# EAGLE schematic clock_PC_and_instruction_reg (EAGLE 9.6.1)
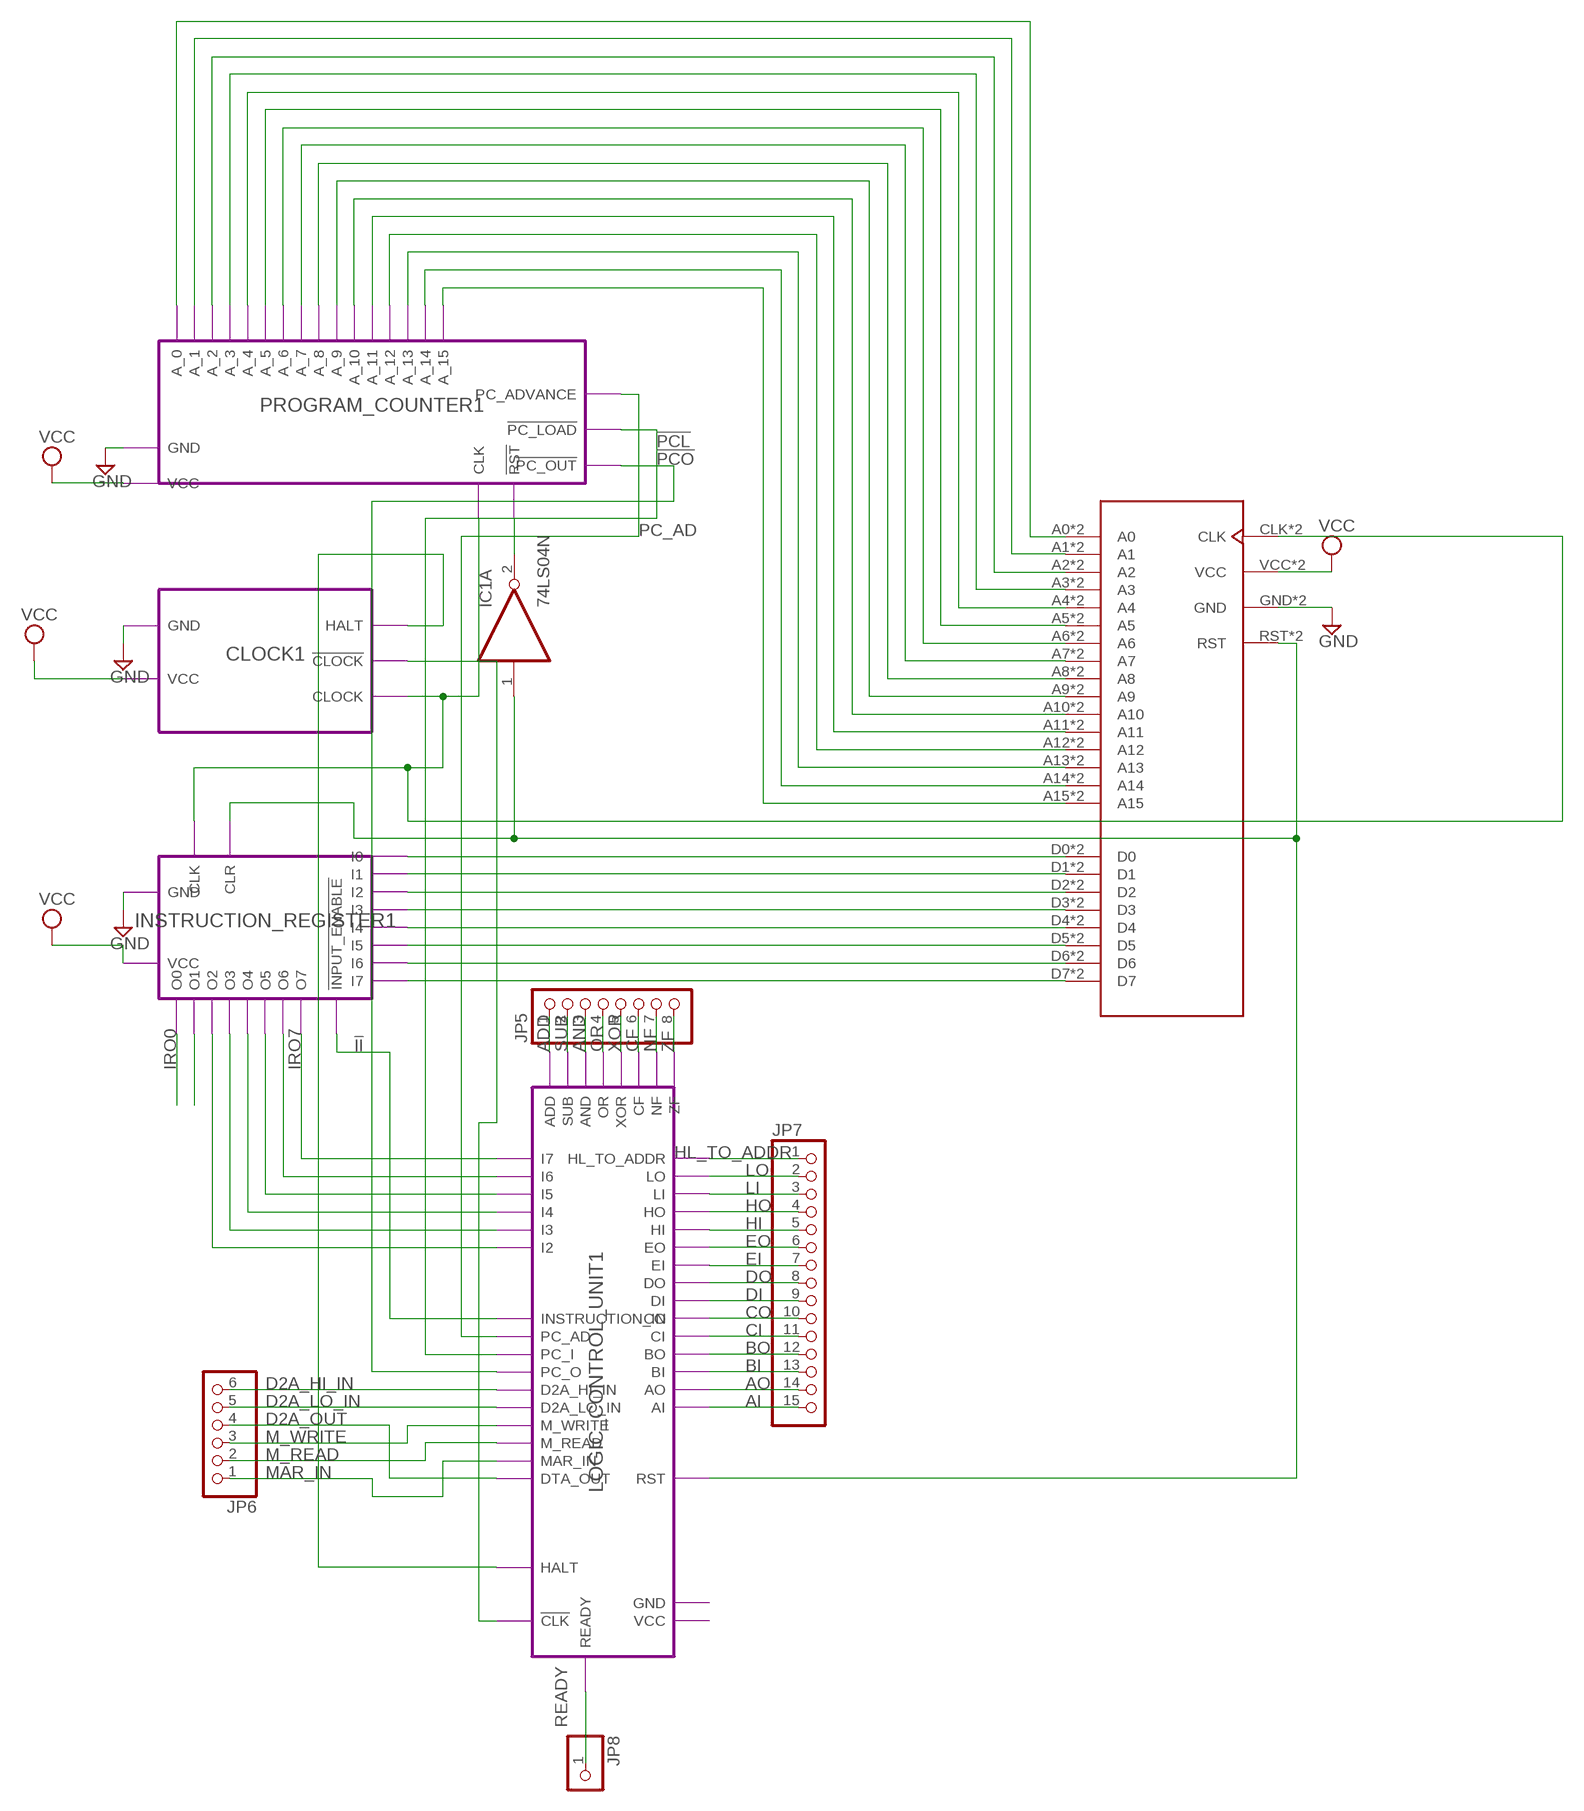
[diagram p0: schematic, sheet 1]

## Parts
IC1  74LS04N  [DIL14]
JP5  PINHD-1X8/90  [1X08/90]
JP6  PINHD-1X6/90  [1X06/90]
JP7  PINHD-1X15/90  [1X15/90]
JP8  PINHD-1X1  [1X01]
U$1  PORT_BOARD  [PORT_FOOTPT]

## Module instances
CLOCK1 = CLOCK
PROGRAM_COUNTER1 = PROGRAM_COUNTER
INSTRUCTION_REGISTER1 = INSTRUCTION_REGISTER
LOGIC_CONTROL_UNIT1 = LOGIC_CONTROL_UNIT

## Nets
!II: port INSTRUCTION_REGISTER1.!INPUT_ENABLE LOGIC_CONTROL_UNIT1.INSTRUCTION_IN
!PCL: port PROGRAM_COUNTER1.!PC_LOAD LOGIC_CONTROL_UNIT1.PC_I
!PCO: port PROGRAM_COUNTER1.!PC_OUT LOGIC_CONTROL_UNIT1.PC_O
ADD: JP5.1 ; port LOGIC_CONTROL_UNIT1.ADD
AI: JP7.15 ; port LOGIC_CONTROL_UNIT1.AI
AND: JP5.3 ; port LOGIC_CONTROL_UNIT1.AND
AO: JP7.14 ; port LOGIC_CONTROL_UNIT1.AO
BI: JP7.13 ; port LOGIC_CONTROL_UNIT1.BI
BO: JP7.12 ; port LOGIC_CONTROL_UNIT1.BO
CF: JP5.6 ; port LOGIC_CONTROL_UNIT1.CF
CI: JP7.11 ; port LOGIC_CONTROL_UNIT1.CI
CO: JP7.10 ; port LOGIC_CONTROL_UNIT1.CO
D2A_HI_IN: JP6.6 ; port LOGIC_CONTROL_UNIT1.D2A_HI_IN
D2A_LO_IN: JP6.5 ; port LOGIC_CONTROL_UNIT1.D2A_LO_IN
D2A_OUT: JP6.4 ; port LOGIC_CONTROL_UNIT1.DTA_OUT
DI: JP7.9 ; port LOGIC_CONTROL_UNIT1.DI
DO: JP7.8 ; port LOGIC_CONTROL_UNIT1.DO
EI: JP7.7 ; port LOGIC_CONTROL_UNIT1.EI
EO: JP7.6 ; port LOGIC_CONTROL_UNIT1.EO
GND: U$1.GND U$1.GND1(GND) ; port PROGRAM_COUNTER1.GND CLOCK1.GND INSTRUCTION_REGISTER1.GND
HALT: port CLOCK1.HALT LOGIC_CONTROL_UNIT1.HALT
HI: JP7.5 ; port LOGIC_CONTROL_UNIT1.HI
HL_TO_ADDR: JP7.1 ; port LOGIC_CONTROL_UNIT1.HL_TO_ADDR
HO: JP7.4 ; port LOGIC_CONTROL_UNIT1.HO
IRO0: port INSTRUCTION_REGISTER1.O0
IRO7: port INSTRUCTION_REGISTER1.O7 LOGIC_CONTROL_UNIT1.I7
LI: JP7.3 ; port LOGIC_CONTROL_UNIT1.LI
LO: JP7.2 ; port LOGIC_CONTROL_UNIT1.LO
M_READ: JP6.2 ; port LOGIC_CONTROL_UNIT1.M_READ
M_WRITE: JP6.3 ; port LOGIC_CONTROL_UNIT1.M_WRITE
MAR_IN: JP6.1 ; port LOGIC_CONTROL_UNIT1.MAR_IN
N$1: U$1.A15 U$1.A31(A15) ; port PROGRAM_COUNTER1.A_15
N$2: U$1.A14 U$1.A30(A14) ; port PROGRAM_COUNTER1.A_14
N$3: U$1.A13 U$1.A29(A13) ; port PROGRAM_COUNTER1.A_13
N$4: U$1.A12 U$1.A28(A12) ; port PROGRAM_COUNTER1.A_12
N$5: U$1.A11 U$1.A27(A11) ; port PROGRAM_COUNTER1.A_11
N$6: U$1.A10 U$1.A26(A10) ; port PROGRAM_COUNTER1.A_10
N$7: U$1.A9 U$1.A25(A9) ; port PROGRAM_COUNTER1.A_9
N$8: U$1.A8 U$1.A24(A8) ; port PROGRAM_COUNTER1.A_8
N$9: U$1.A7 U$1.A23(A7) ; port PROGRAM_COUNTER1.A_7
N$10: U$1.A6 U$1.A22(A6) ; port PROGRAM_COUNTER1.A_6
N$11: U$1.A5 U$1.A21(A5) ; port PROGRAM_COUNTER1.A_5
N$12: U$1.A4 U$1.A20(A4) ; port PROGRAM_COUNTER1.A_4
N$13: U$1.A3 U$1.A19(A3) ; port PROGRAM_COUNTER1.A_3
N$14: U$1.A2 U$1.A18(A2) ; port PROGRAM_COUNTER1.A_2
N$15: U$1.A1 U$1.A17(A1) ; port PROGRAM_COUNTER1.A_1
N$16: U$1.A0 U$1.A16(A0) ; port PROGRAM_COUNTER1.A_0
N$17: U$1.D0 U$1.D8(D0) ; port INSTRUCTION_REGISTER1.I0
N$18: U$1.D1 U$1.D9(D1) ; port INSTRUCTION_REGISTER1.I1
N$19: U$1.D2 U$1.D10(D2) ; port INSTRUCTION_REGISTER1.I2
N$20: U$1.D3 U$1.D11(D3) ; port INSTRUCTION_REGISTER1.I3
N$21: U$1.D4 U$1.D12(D4) ; port INSTRUCTION_REGISTER1.I4
N$22: U$1.D5 U$1.D13(D5) ; port INSTRUCTION_REGISTER1.I5
N$23: U$1.D6 U$1.D14(D6) ; port INSTRUCTION_REGISTER1.I6
N$24: U$1.D7 U$1.D15(D7) ; port INSTRUCTION_REGISTER1.I7
N$25: U$1.CLK U$1.CLK1(CLK) ; port INSTRUCTION_REGISTER1.CLK CLOCK1.CLOCK PROGRAM_COUNTER1.CLK
N$26: IC1.1(A:I) U$1.RST U$1.RST1(RST) ; port INSTRUCTION_REGISTER1.CLR LOGIC_CONTROL_UNIT1.RST
N$27: IC1.2(A:O) ; port PROGRAM_COUNTER1.!RST
N$28: port INSTRUCTION_REGISTER1.O6 LOGIC_CONTROL_UNIT1.I6
N$29: port INSTRUCTION_REGISTER1.O5 LOGIC_CONTROL_UNIT1.I5
N$30: port INSTRUCTION_REGISTER1.O4 LOGIC_CONTROL_UNIT1.I4
N$31: port INSTRUCTION_REGISTER1.O3 LOGIC_CONTROL_UNIT1.I3
N$32: port INSTRUCTION_REGISTER1.O2 LOGIC_CONTROL_UNIT1.I2
N$33: port INSTRUCTION_REGISTER1.O1
N$34: port CLOCK1.!CLOCK LOGIC_CONTROL_UNIT1.!CLK
NF: JP5.7 ; port LOGIC_CONTROL_UNIT1.NF
OR: JP5.4 ; port LOGIC_CONTROL_UNIT1.OR
PC_AD: port PROGRAM_COUNTER1.PC_ADVANCE LOGIC_CONTROL_UNIT1.PC_AD
READY: JP8.1 ; port LOGIC_CONTROL_UNIT1.READY
SUB: JP5.2 ; port LOGIC_CONTROL_UNIT1.SUB
VCC: U$1.VCC U$1.VCC1(VCC) ; port PROGRAM_COUNTER1.VCC CLOCK1.VCC INSTRUCTION_REGISTER1.VCC
XOR: JP5.5 ; port LOGIC_CONTROL_UNIT1.XOR
ZF: JP5.8 ; port LOGIC_CONTROL_UNIT1.ZF
Unconnected: IC1.3(B:I) IC1.4(B:O) IC1.5(C:I) IC1.6(C:O) IC1.8(D:O) IC1.9(D:I) IC1.10(E:O) IC1.11(E:I) IC1.12(F:O) IC1.13(F:I)

## Power pins joined to a net without a drawn wire
GND: IC1.7(P:GND)
VCC: IC1.14(P:VCC)

## Library data of the parts
IC1 = 74xx-eu:74*04: Hex INVERTER
JP5 = pinhead:PINHD-1X8: PIN HEADER
JP6 = pinhead:PINHD-1X6: PIN HEADER
JP7 = pinhead:PINHD-1X15: PIN HEADER
JP8 = pinhead:PINHD-1X1: PIN HEADER
U$1 = stack_interface:PORT_BOARD

## Module CLOCK
Ports: CLOCK(out) HALT(in) GND(pwr) VCC(pwr) !CLOCK(out)
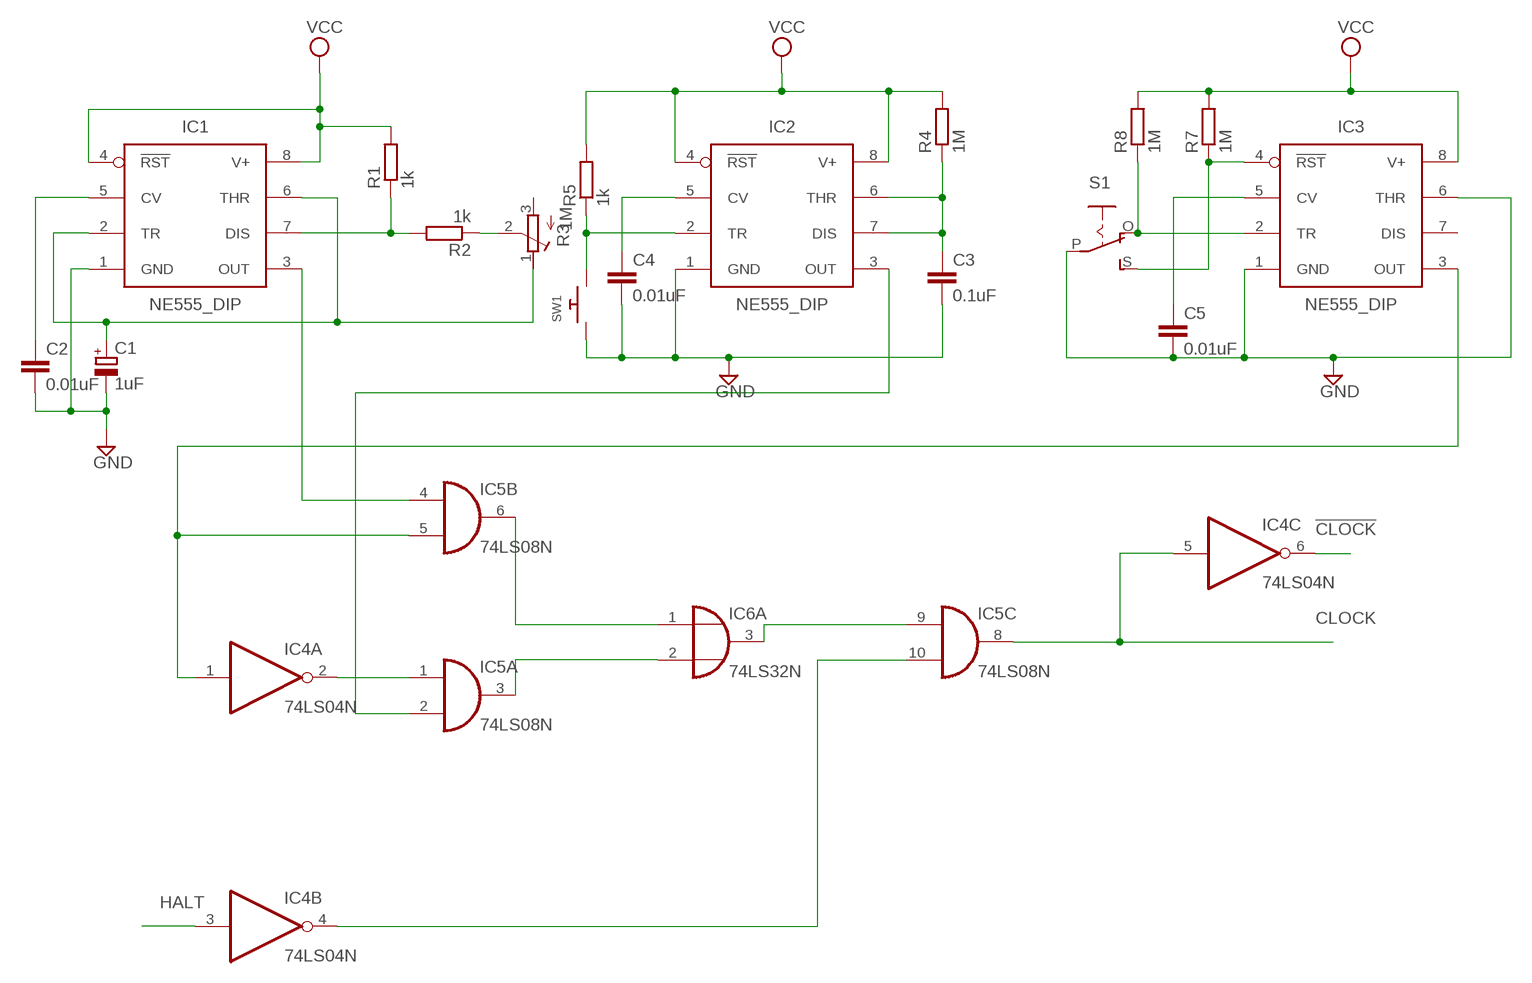
[diagram p1: schematic, module CLOCK, sheet 1]

### Parts
C1  1uF  CPOL-EUE2-5  [E2-5]
C2  0.01uF  C-EU025-025X050  [C025-025X050]
C3  0.1uF  C-EU025-025X050  [C025-025X050]
C4  0.01uF  C-EU025-025X050  [C025-025X050]
C5  0.01uF  C-EU025-025X050  [C025-025X050]
IC1  NE555_DIP  [DIP826W53P254L959H508Q8B]
IC2  NE555_DIP  [DIP826W53P254L959H508Q8B]
IC3  NE555_DIP  [DIP826W53P254L959H508Q8B]
IC4  74LS04N  [DIL14]
IC5  74LS08N  [DIL14]
IC6  74LS32N  [DIL14]
R1  1k  R-EU_0204/7  [0204/7]
R2  1k  R-EU_0204/7  [0204/7]
R3  1M  R-TRIMM3314J  [RTRIM3314J]
R4  1M  R-EU_0207/7  [0207/7]
R5  1k  R-EU_0207/7  [0207/7]
R7  1M  R-EU_0207/7  [0207/7]
R8  1M  R-EU_0207/7  [0207/7]
S1  EG1218S  [EG1218]
SW1  SWITCH_PUSHBUTTONSOFTTOUCHSMD_SJ  [PUSHBUTTON_SMD_SJ]

### Nets
!CLOCK: IC4.6(C:O)
CLOCK: IC4.5(C:I) IC5.8(C:O)
GND: C1.- C2.2 C3.2 C4.2 C5.2 IC1.1(GND) IC2.1(GND) IC3.1(GND) IC3.6(THR) S1.P SW1.P$1
HALT: IC4.3(B:I)
N$1: IC1.7(DIS) R1.1 R2.2
N$2: R2.1 R3.2(S)
N$3: C1.+ IC1.2(TR) IC1.6(THR) R3.1(E)
N$4: C3.1 IC2.6(THR) IC2.7(DIS) R4.1
N$5: C2.1 IC1.5(CV)
N$6: IC1.3(OUT) IC5.4(B:I0)
N$7: IC4.2(A:O) IC5.1(A:I0)
N$8: IC2.3(OUT) IC5.2(A:I1)
N$9: IC3.3(OUT) IC4.1(A:I) IC5.5(B:I1)
N$10: IC5.6(B:O) IC6.1(A:I0)
N$11: IC5.3(A:O) IC6.2(A:I1)
N$12: IC4.4(B:O) IC5.10(C:I1)
N$13: IC5.9(C:I0) IC6.3(A:O)
N$14: C4.1 IC2.5(CV)
N$15: IC2.2(TR) R5.1 SW1.P$2
N$17: IC3.2(TR) R8.1 S1.O
N$18: IC3.4(!RST) R7.1 S1.S
N$19: C5.1 IC3.5(CV)
VCC: IC1.4(!RST) IC1.8(V+) IC2.4(!RST) IC2.8(V+) IC3.8(V+) R1.2 R4.2 R5.2 R7.2 R8.2
Unconnected: IC3.7(DIS) IC4.8(D:O) IC4.9(D:I) IC4.10(E:O) IC4.11(E:I) IC4.12(F:O) IC4.13(F:I) IC5.11(D:O) IC5.12(D:I0) IC5.13(D:I1) IC6.4(B:I0) IC6.5(B:I1) IC6.6(B:O) IC6.8(C:O) IC6.9(C:I0) IC6.10(C:I1) IC6.11(D:O) IC6.12(D:I0) IC6.13(D:I1) R3.3(A)

### Power pins joined to a net without a drawn wire
GND: IC4.7(P:GND) IC5.7(P:GND) IC6.7(P:GND)
VCC: IC4.14(P:VCC) IC5.14(P:VCC) IC6.14(P:VCC)

### Library data of the parts
C1 = resistor:CPOL-EU: POLARIZED CAPACITOR, European symbol; SPICEPREFIX: C
C2-C5 = resistor:C-EU: CAPACITOR, European symbol; SPICEPREFIX: C
IC1 = IC_Clock-Timing:*555: TIMER 555 General purpose precision timers NE555 : Texas Datasheet <http://www.ti.com/general/docs/suppproductinfo.tsp?distId=10&gotoUrl=http%3A%2F%2Fwww.ti.com%2Flit%2Fgpn%2Fne555>, Diodes Incorporated Datasheet <https://www.diodes.com/assets/Datasheets/NE555_SA555_NA555.pdf> LM555 Datasheet <http://www.ti.com/general/docs/suppproductinfo.tsp?distId=10&gotoUrl=http%3A%2F%2Fwww.ti.com%2Flit%2Fgpn%2Flm555> LMC555 Datasheet <http://www.ti.com/general/docs/suppproductinfo.tsp?distId=10&gotoUrl=http%3A%2F%2Fwww.ti.com%2Flit%2Fgpn%2Flmc555> ICM7555 : Maxim Integrated Datasheet <https://datasheets.maximintegrated.com/en/ds/ICM7555-ICM7556.pdf>, Renesas Electronics America Inc Datasheet <https://www.renesas.com/en-us/www/doc/datasheet/icm7555-56.pdf>; CATEGORY: IC_Clock-Timing; CURRENT-SUPPLY: 10mA; DESCRIPTION: IC OSC SINGLE TIMER 100KHZ 8-DIP; FREQUENCY: 100kHz; MANUFACTURER: Texas Instruments; MPN: NE555P; OPERATING_TEMP: 0°C to 70°C; PART_STATUS: Active; ROHS_COMPLIANT: ROHS3 Compliant; SPICEMODEL: NE555; SPICEPREFIX: X; SUB-CATEGORY: Timer
IC2 IC3 = IC_Clock-Timing:*555: TIMER 555 General purpose precision timers NE555 : Texas Datasheet <http://www.ti.com/general/docs/suppproductinfo.tsp?distId=10&gotoUrl=http%3A%2F%2Fwww.ti.com%2Flit%2Fgpn%2Fne555>, Diodes Incorporated Datasheet <https://www.diodes.com/assets/Datasheets/NE555_SA555_NA555.pdf> LM555 Datasheet <http://www.ti.com/general/docs/suppproductinfo.tsp?distId=10&gotoUrl=http%3A%2F%2Fwww.ti.com%2Flit%2Fgpn%2Flm555> LMC555 Datasheet <http://www.ti.com/general/docs/suppproductinfo.tsp?distId=10&gotoUrl=http%3A%2F%2Fwww.ti.com%2Flit%2Fgpn%2Flmc555> ICM7555 : Maxim Integrated Datasheet <https://datasheets.maximintegrated.com/en/ds/ICM7555-ICM7556.pdf>, Renesas Electronics America Inc Datasheet <https://www.renesas.com/en-us/www/doc/datasheet/icm7555-56.pdf>; CATEGORY: IC_Clock-Timing; CURRENT-SUPPLY: 10mA; DESCRIPTION: IC OSC SINGLE TIMER 100KHZ 8-DIP; FREQUENCY: 100kHz; MANUFACTURER: Texas Instruments; MPN: NE555P; OPERATING_TEMP: 0°C to 70°C; PART_STATUS: Active; ROHS_COMPLIANT: ROHS3 Compliant; SUB-CATEGORY: Timer
IC4 = 74xx-eu:74*04: Hex INVERTER
IC5 = 74xx-eu:74*08: Quad 2-input AND gate; SPICEPREFIX: J
IC6 = 74xx-eu:74*32: Quad 2-input OR gate
R1 R2 = resistor:R-EU_: RESISTOR, European symbol; SPICEPREFIX: R
R3 = resistor:R-TRIMM: Trimm resistor; SPICEPREFIX: X
R4 R5 R7 R8 = resistor:R-EU_: RESISTOR, European symbol
S1 = adafruit:EG1218: SLIDING SWITCH 0.1" spacing through hole, vertical SPDT slide switch http://www.ladyada.net/library/pcb/eaglelibrary.html
SW1 = adafruit:SWITCH_PUSHBUTTON: Buttons SOFTTOUCHSMD_SJ - Soft touch temporary push button (Super Junk Akihabara) Compatible with SKPMANE010 [Mouser: 688-SKPMAN] C&K_KSS = Digikey: KSS221GLFS; SPICEPREFIX: B

## Module DATA_REGISTOR
Ports: DATA_0(io) DATA_1(io) DATA_2(io) DATA_3(io) DATA_4(io) DATA_5(io) DATA_6(io) DATA_7(io) !INPUT_ENABLE(in) !OUTPUT_ENABLE(in) CLOCK(in) CLR(in) UB_0(out) UB_1(out) UB_2(out) UB_3(out) UB_4(out) UB_5(out) UB_6(out) UB_7(out) VCC(pwr) GND(pwr)
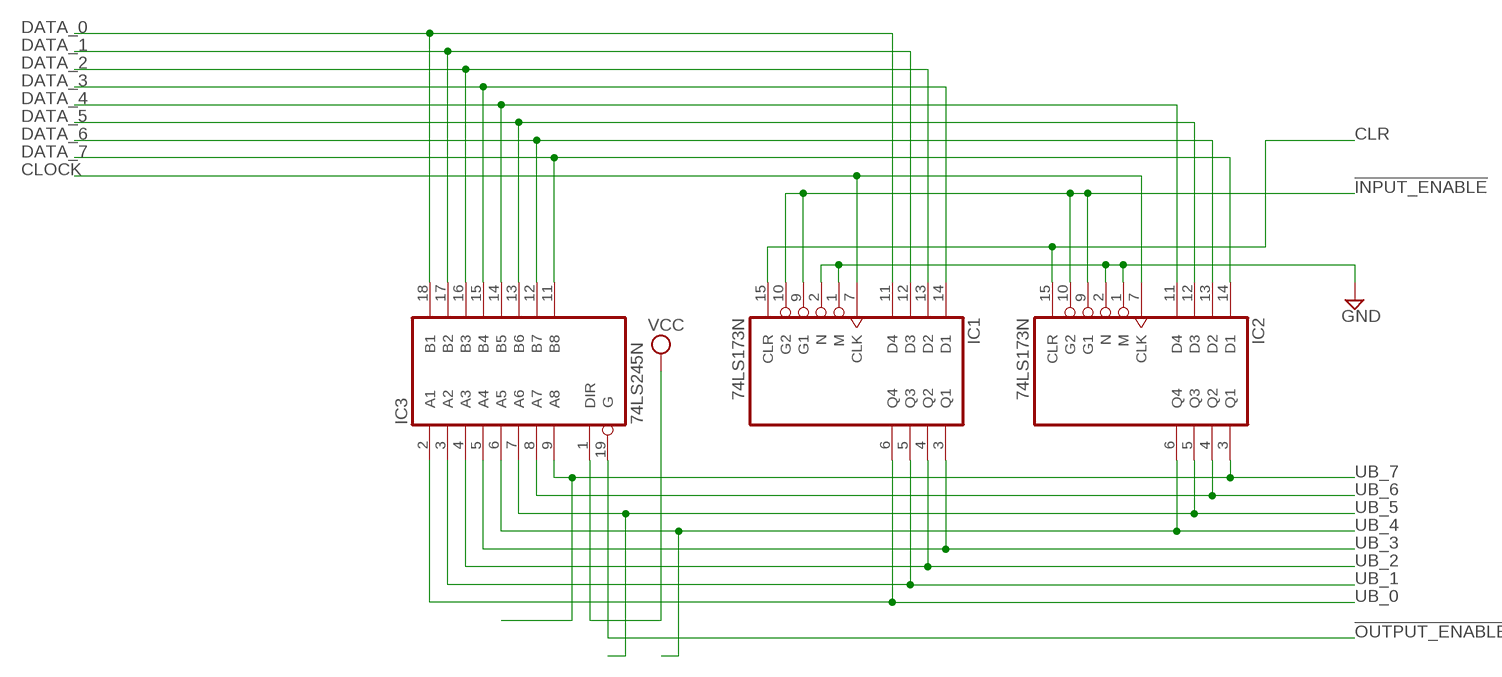
[diagram p2: schematic, module DATA_REGISTOR, sheet 1]

### Parts
IC1  74LS173N  [DIL16]
IC2  74LS173N  [DIL16]
IC3  74LS245N  [DIL20]

### Nets
!INPUT_ENABLE: IC1.9(G1) IC1.10(G2) IC2.9(G1) IC2.10(G2)
!OUTPUT_ENABLE: IC3.19(G)
CLOCK: IC1.7(CLK) IC2.7(CLK)
CLR: IC1.15(CLR) IC2.15(CLR)
DATA_0: IC1.11(D4) IC3.18(B1)
DATA_1: IC1.12(D3) IC3.17(B2)
DATA_2: IC1.13(D2) IC3.16(B3)
DATA_3: IC1.14(D1) IC3.15(B4)
DATA_4: IC2.11(D4) IC3.14(B5)
DATA_5: IC2.12(D3) IC3.13(B6)
DATA_6: IC2.13(D2) IC3.12(B7)
DATA_7: IC2.14(D1) IC3.11(B8)
GND: IC1.1(M) IC1.2(N) IC2.1(M) IC2.2(N)
UB_0: IC1.6(Q4) IC3.2(A1)
UB_1: IC1.5(Q3) IC3.3(A2)
UB_2: IC1.4(Q2) IC3.4(A3)
UB_3: IC1.3(Q1) IC3.5(A4)
UB_4: IC2.6(Q4) IC3.6(A5)
UB_5: IC2.5(Q3) IC3.7(A6)
UB_6: IC2.4(Q2) IC3.8(A7)
UB_7: IC2.3(Q1) IC3.9(A8)
VCC: IC3.1(DIR)

### Power pins joined to a net without a drawn wire
GND: IC1.8(GND) IC2.8(GND) IC3.10(GND)
VCC: IC1.16(VCC) IC2.16(VCC) IC3.20(VCC)

### Library data of the parts
IC1 IC2 = 74xx-eu:74*173: 4-bit D type REGISTER, 3-state
IC3 = 74xx-eu:74*245: Octal BUS TRANSCEIVER, 3-state

## Module PROGRAM_COUNTER
Ports: A_0(io) A_1(io) A_2(io) A_3(io) A_4(io) A_5(io) A_6(io) A_7(io) A_8(io) A_9(io) A_10(io) A_11(io) A_12(io) A_13(io) A_14(io) A_15(io) !PC_OUT(io) !PC_LOAD(io) PC_ADVANCE(in) GND(pwr) VCC(pwr) CLK(in) !RST(in)
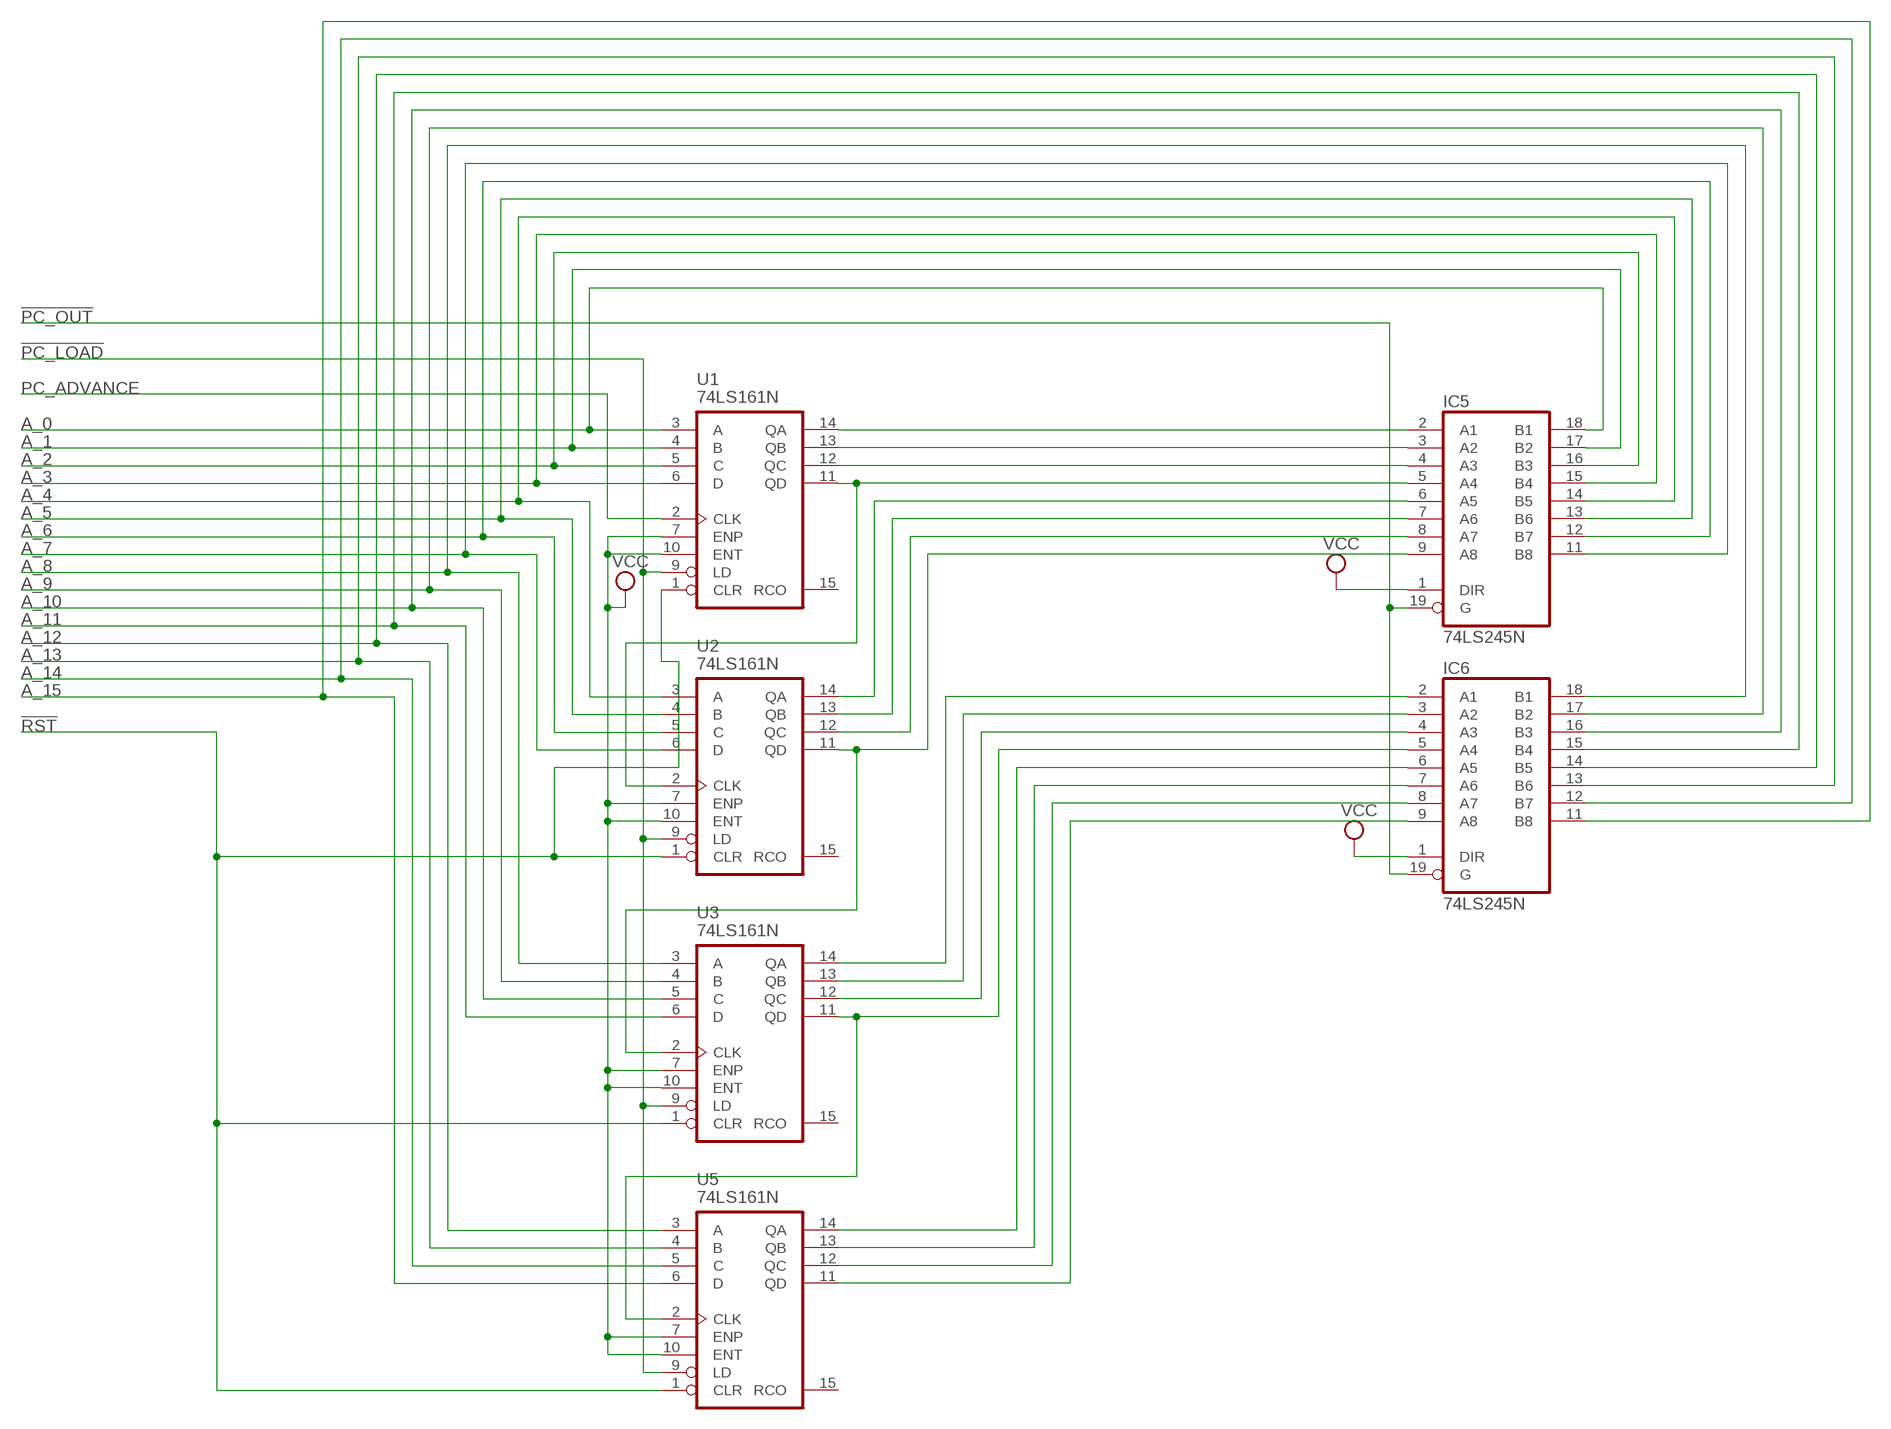
[diagram p3: schematic, module PROGRAM_COUNTER, sheet 1]

### Parts
IC5  74LS245N  [DIL20]
IC6  74LS245N  [DIL20]
U1  74LS161N  [DIL16]
U2  74LS161N  [DIL16]
U3  74LS161N  [DIL16]
U5  74LS161N  [DIL16]

### Nets
!PC_LOAD: U1.9(LD) U2.9(LD) U3.9(LD) U5.9(LD)
!PC_OUT: IC5.19(G) IC6.19(G)
!RST: U1.1(CLR) U2.1(CLR) U3.1(CLR) U5.1(CLR)
A_0: IC5.18(B1) U1.3(A)
A_1: IC5.17(B2) U1.4(B)
A_2: IC5.16(B3) U1.5(C)
A_3: IC5.15(B4) U1.6(D)
A_4: IC5.14(B5) U2.3(A)
A_5: IC5.13(B6) U2.4(B)
A_6: IC5.12(B7) U2.5(C)
A_7: IC5.11(B8) U2.6(D)
A_8: IC6.18(B1) U3.3(A)
A_9: IC6.17(B2) U3.4(B)
A_10: IC6.16(B3) U3.5(C)
A_11: IC6.15(B4) U3.6(D)
A_12: IC6.14(B5) U5.3(A)
A_13: IC6.13(B6) U5.4(B)
A_14: IC6.12(B7) U5.5(C)
A_15: IC6.11(B8) U5.6(D)
N$2: IC5.5(A4) U1.11(QD) U2.2(CLK)
N$3: IC5.9(A8) U2.11(QD) U3.2(CLK)
N$4: IC6.5(A4) U3.11(QD) U5.2(CLK)
N$23: IC5.2(A1) U1.14(QA)
N$24: IC5.3(A2) U1.13(QB)
N$25: IC5.4(A3) U1.12(QC)
N$26: IC5.6(A5) U2.14(QA)
N$27: IC5.7(A6) U2.13(QB)
N$28: IC5.8(A7) U2.12(QC)
N$30: IC6.2(A1) U3.14(QA)
N$31: IC6.3(A2) U3.13(QB)
N$32: IC6.4(A3) U3.12(QC)
N$34: IC6.6(A5) U5.14(QA)
N$35: IC6.7(A6) U5.13(QB)
N$36: IC6.8(A7) U5.12(QC)
N$37: IC6.9(A8) U5.11(QD)
PC_ADVANCE: U1.2(CLK)
VCC: IC5.1(DIR) IC6.1(DIR) U1.7(ENP) U1.10(ENT) U2.7(ENP) U2.10(ENT) U3.7(ENP) U3.10(ENT) U5.7(ENP) U5.10(ENT)
Unconnected: U1.15(RCO) U2.15(RCO) U3.15(RCO) U5.15(RCO)

### Power pins joined to a net without a drawn wire
GND: IC5.10(GND) IC6.10(GND) U1.8(GND) U2.8(GND) U3.8(GND) U5.8(GND)
VCC: IC5.20(VCC) IC6.20(VCC) U1.16(VCC) U2.16(VCC) U3.16(VCC) U5.16(VCC)

### Library data of the parts
IC5 IC6 = 74xx-eu:74*245: Octal BUS TRANSCEIVER, 3-state
U1-U3 U5 = oldchips:74*161: Synchronous 4-bit COUNTER with direct clear

## Module INSTRUCTION_REGISTER
Ports: I0(in) I1(in) I2(in) I3(in) I4(in) I5(in) I6(in) I7(in) O0(out) O1(out) O2(out) O3(out) O4(out) O5(out) O6(out) O7(out) !INPUT_ENABLE(in) CLK(in) CLR(in) GND(pwr) VCC(pwr)
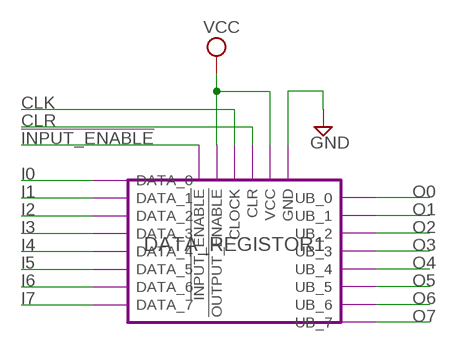
[diagram p4: schematic, module INSTRUCTION_REGISTER, sheet 1]

### Module instances
DATA_REGISTOR1 = DATA_REGISTOR

### Nets
!INPUT_ENABLE: port DATA_REGISTOR1.!INPUT_ENABLE
CLK: port DATA_REGISTOR1.CLOCK
CLR: port DATA_REGISTOR1.CLR
GND: port DATA_REGISTOR1.GND
I0: port DATA_REGISTOR1.DATA_0
I1: port DATA_REGISTOR1.DATA_1
I2: port DATA_REGISTOR1.DATA_2
I3: port DATA_REGISTOR1.DATA_3
I4: port DATA_REGISTOR1.DATA_4
I5: port DATA_REGISTOR1.DATA_5
I6: port DATA_REGISTOR1.DATA_6
I7: port DATA_REGISTOR1.DATA_7
O0: port DATA_REGISTOR1.UB_0
O1: port DATA_REGISTOR1.UB_1
O2: port DATA_REGISTOR1.UB_2
O3: port DATA_REGISTOR1.UB_3
O4: port DATA_REGISTOR1.UB_4
O5: port DATA_REGISTOR1.UB_5
O6: port DATA_REGISTOR1.UB_6
O7: port DATA_REGISTOR1.UB_7
VCC: port DATA_REGISTOR1.!OUTPUT_ENABLE DATA_REGISTOR1.VCC

### Library data of the parts

## Module LOGIC_CONTROL_UNIT
Ports: I2(in) I3(in) I4(in) I5(in) I6(in) I7(in) PC_AD(out) PC_I(out) PC_O(out) D2A_HI_IN(out) D2A_LO_IN(out) M_WRITE(out) M_READ(out) MAR_IN(out) INSTRUCTION_IN(out) HL_TO_ADDR(out) LO(out) LI(out) HO(out) HI(out) EO(out) EI(out) DTA_OUT(out) DO(out) DI(out) CO(out) CI(out) BO(out) BI(out) AO(out) AI(out) ADD(out) SUB(out) AND(out) OR(out) XOR(out) RST(out) CF(in) NF(in) ZF(in) READY(in) !CLK(in) VCC(pwr) GND(pwr) HALT(out)
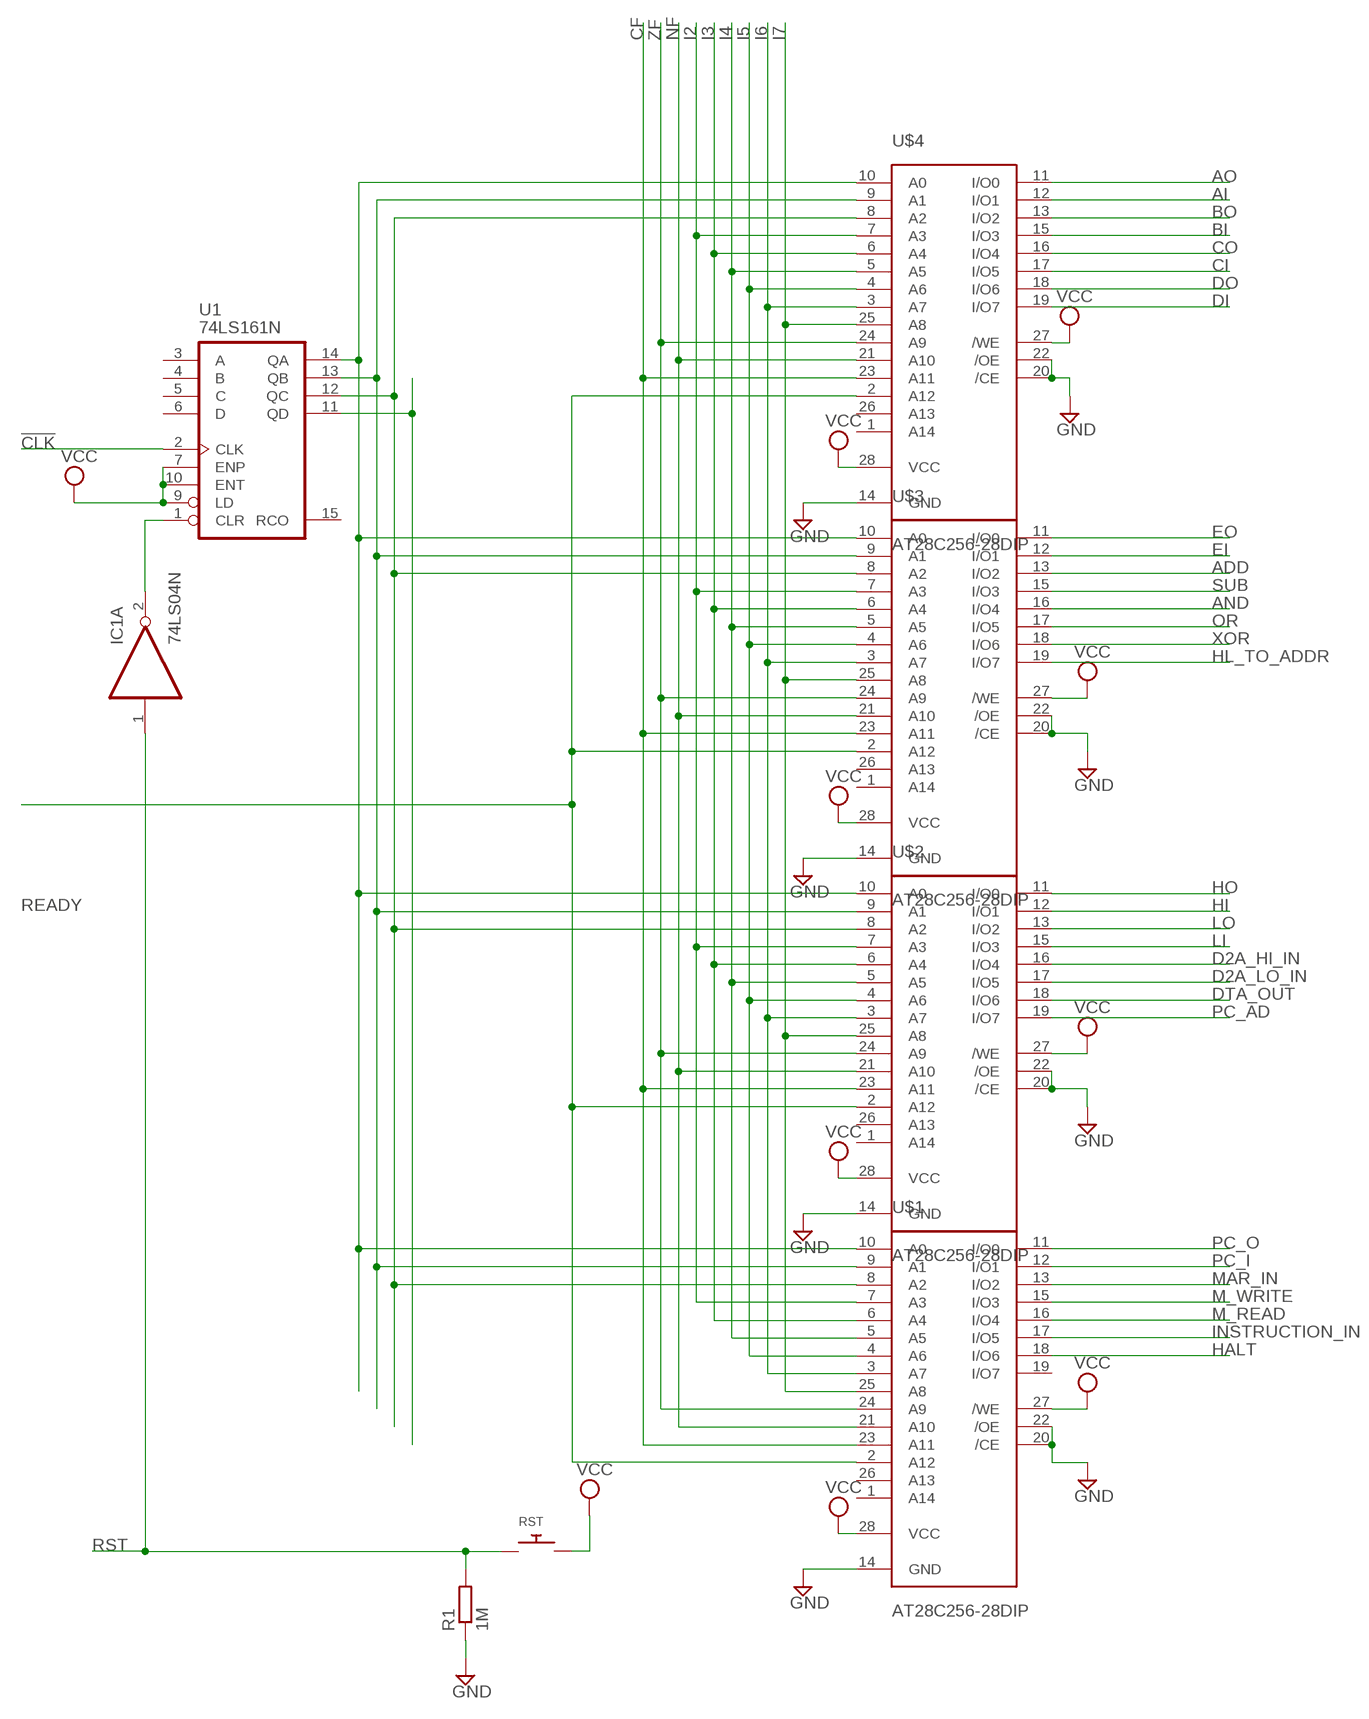
[diagram p5: schematic, module LOGIC_CONTROL_UNIT, sheet 1]

### Parts
IC1  74LS04N  [DIL14]
R1  1M  R-EU_0207/7  [0207/7]
RST  SWITCH_PUSHBUTTONSOFTTOUCHSMD_SJ  [PUSHBUTTON_SMD_SJ]
U1  74LS161N  [DIL16]
U$1  AT28C256-28DIP  [DIL28-6]
U$2  AT28C256-28DIP  [DIL28-6]
U$3  AT28C256-28DIP  [DIL28-6]
U$4  AT28C256-28DIP  [DIL28-6]

### Nets
!CLK: U1.2(CLK)
ADD: U$3.13(I/O2)
AI: U$4.12(I/O1)
AND: U$3.16(I/O4)
AO: U$4.11(I/O0)
BI: U$4.15(I/O3)
BO: U$4.13(I/O2)
CF: U$1.23(A11) U$2.23(A11) U$3.23(A11) U$4.23(A11)
CI: U$4.17(I/O5)
CO: U$4.16(I/O4)
D2A_HI_IN: U$2.16(I/O4)
D2A_LO_IN: U$2.17(I/O5)
DI: U$4.19(I/O7)
DO: U$4.18(I/O6)
DTA_OUT: U$2.18(I/O6)
EI: U$3.12(I/O1)
EO: U$3.11(I/O0)
GND: R1.1 U$1.14(GND) U$1.20(/CE) U$1.22(/OE) U$2.14(GND) U$2.20(/CE) U$2.22(/OE) U$3.14(GND) U$3.20(/CE) U$3.22(/OE) U$4.14(GND) U$4.20(/CE) U$4.22(/OE)
HALT: U$1.18(I/O6)
HI: U$2.12(I/O1)
HL_TO_ADDR: U$3.19(I/O7)
HO: U$2.11(I/O0)
I2: U$1.7(A3) U$2.7(A3) U$3.7(A3) U$4.7(A3)
I3: U$1.6(A4) U$2.6(A4) U$3.6(A4) U$4.6(A4)
I4: U$1.5(A5) U$2.5(A5) U$3.5(A5) U$4.5(A5)
I5: U$1.4(A6) U$2.4(A6) U$3.4(A6) U$4.4(A6)
I6: U$1.3(A7) U$2.3(A7) U$3.3(A7) U$4.3(A7)
I7: U$1.25(A8) U$2.25(A8) U$3.25(A8) U$4.25(A8)
INSTRUCTION_IN: U$1.17(I/O5)
LI: U$2.15(I/O3)
LO: U$2.13(I/O2)
M_READ: U$1.16(I/O4)
M_WRITE: U$1.15(I/O3)
MAR_IN: U$1.13(I/O2)
N$1: U1.14(QA) U$1.10(A0) U$2.10(A0) U$3.10(A0) U$4.10(A0)
N$2: IC1.2(A:O) U1.1(CLR)
N$10: U1.13(QB) U$1.9(A1) U$2.9(A1) U$3.9(A1) U$4.9(A1)
N$11: U1.12(QC) U$1.8(A2) U$2.8(A2) U$3.8(A2) U$4.8(A2)
N$12: U1.11(QD)
NF: U$1.21(A10) U$2.21(A10) U$3.21(A10) U$4.21(A10)
OR: U$3.17(I/O5)
PC_AD: U$2.19(I/O7)
PC_I: U$1.12(I/O1)
PC_O: U$1.11(I/O0)
READY: U$1.2(A12) U$2.2(A12) U$3.2(A12) U$4.2(A12)
RST: IC1.1(A:I) R1.2 RST.P$1
SUB: U$3.15(I/O3)
VCC: RST.P$2 U1.7(ENP) U1.9(LD) U1.10(ENT) U$1.27(/WE) U$1.28(VCC) U$2.27(/WE) U$2.28(VCC) U$3.27(/WE) U$3.28(VCC) U$4.27(/WE) U$4.28(VCC)
XOR: U$3.18(I/O6)
ZF: U$1.24(A9) U$2.24(A9) U$3.24(A9) U$4.24(A9)
Unconnected: IC1.3(B:I) IC1.4(B:O) IC1.5(C:I) IC1.6(C:O) IC1.8(D:O) IC1.9(D:I) IC1.10(E:O) IC1.11(E:I) IC1.12(F:O) IC1.13(F:I) U1.3(A) U1.4(B) U1.5(C) U1.6(D) U1.15(RCO) U$1.1(A14) U$1.19(I/O7) U$1.26(A13) U$2.1(A14) U$2.26(A13) U$3.1(A14) U$3.26(A13) U$4.1(A14) U$4.26(A13)

### Power pins joined to a net without a drawn wire
GND: IC1.7(P:GND) U1.8(GND)
VCC: IC1.14(P:VCC) U1.16(VCC)

### Library data of the parts
IC1 = 74xx-eu:74*04: Hex INVERTER
R1 = resistor:R-EU_: RESISTOR, European symbol
RST = adafruit:SWITCH_PUSHBUTTON: Buttons SOFTTOUCHSMD_SJ - Soft touch temporary push button (Super Junk Akihabara) Compatible with SKPMANE010 [Mouser: 688-SKPMAN] C&K_KSS = Digikey: KSS221GLFS; SPICEPREFIX: B
U1 = oldchips:74*161: Synchronous 4-bit COUNTER with direct clear
U$1-U$4 = atmel-custom:AT28C256-28DIP: IC EEPROM 256KBIT 150NS 28DIP